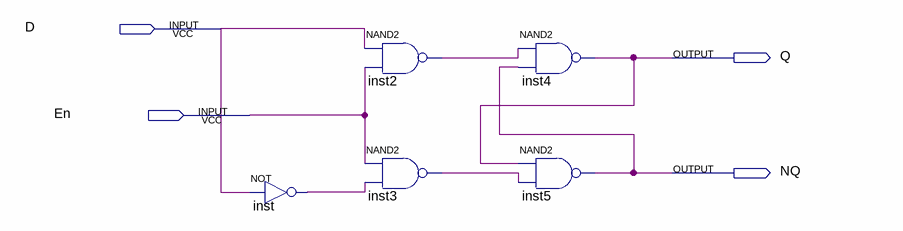
[diagram p0: schematic sheet]
// Quartus schematic Lab5.bdf as structural Verilog: 5 symbols, 4 pins
module Lab5 (
  input  D,
  input  En,
  output Q,
  output NQ
);

  wire inst2_out, inst3_out, inst_out;

  not inst (inst_out, D);
  nand inst2 (inst2_out, D, En);
  nand inst3 (inst3_out, En, inst_out);
  nand inst4 (Q, inst2_out, NQ);
  nand inst5 (NQ, Q, inst3_out);
endmodule
